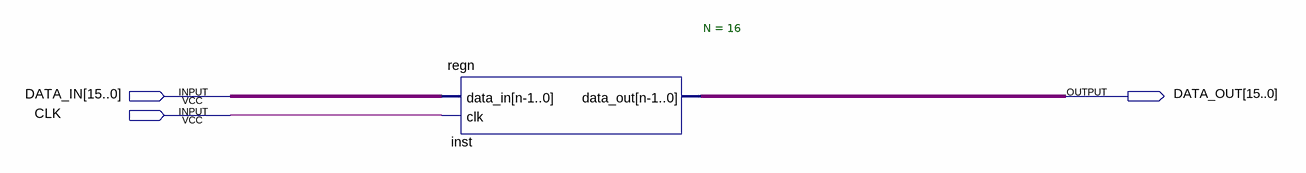
[diagram p0: schematic sheet]
// Quartus schematic test_regn.bdf as structural Verilog: 1 symbols, 3 pins
module test_regn (
  input  [15:0] DATA_IN,
  input  CLK,
  output [15:0] DATA_OUT
);

  regn #(.N(16)) inst (.data_in(DATA_IN), .clk(CLK), .data_out(DATA_OUT));
endmodule
